# EAGLE design rc4.1_1 (EAGLE 9.6.2)
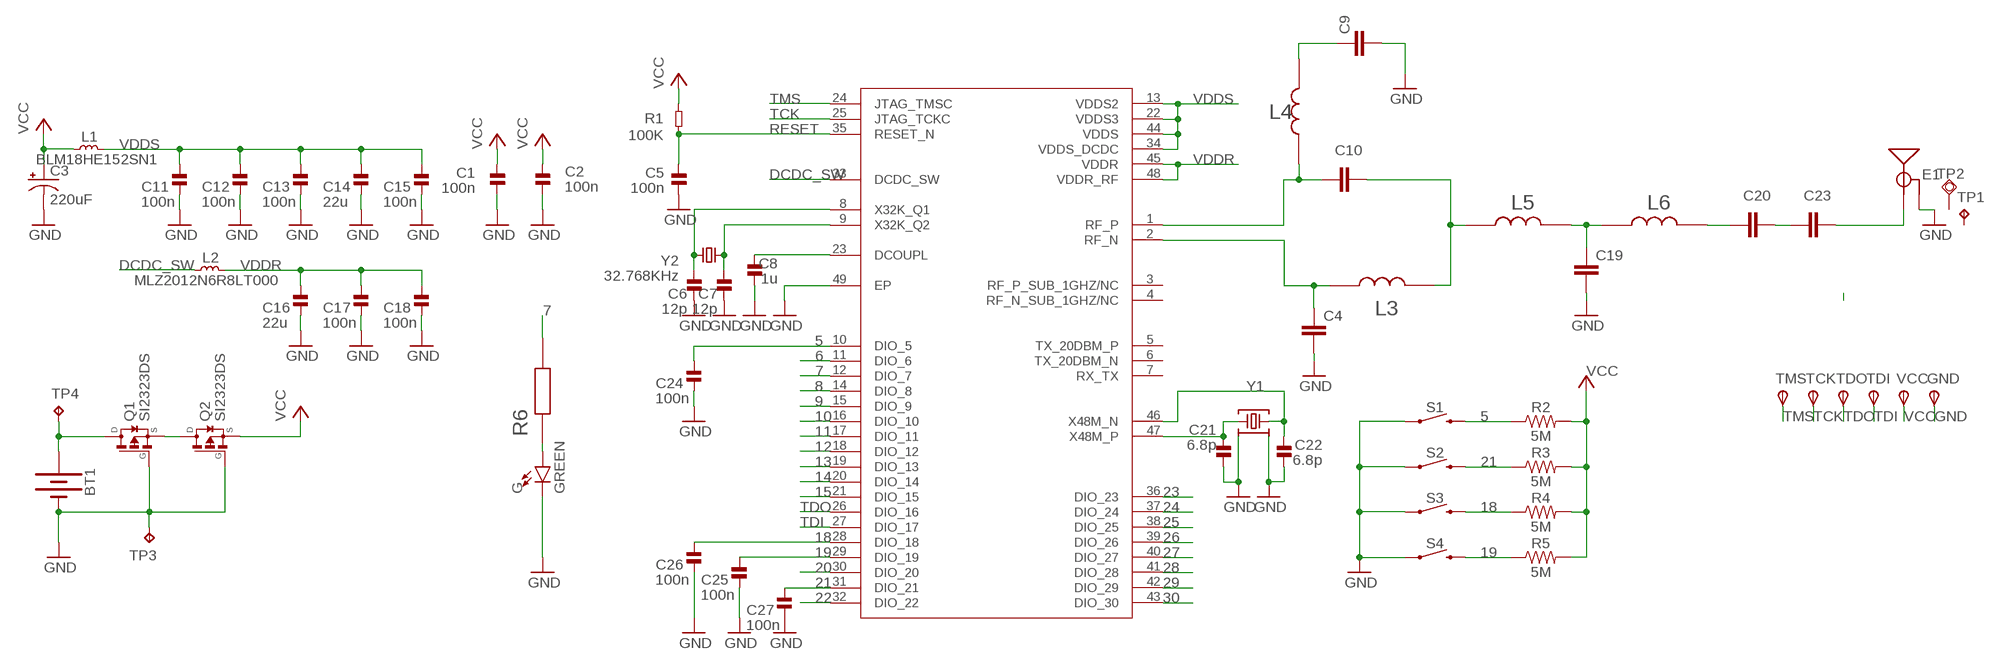
[diagram p0: schematic, sheet 1]

## Parts
BT1  BATTERY-20MM_SMD_4LEGS_OVERPASTE  [BATTCON_20MM_4LEGS_OVERPASTE]
C1  100n  CAP-0402  [_PKG_C_0402]
C2  100n  CAP-0402  [_PKG_C_0402]
C3  220uF  47UF-POLAR-EIA3528-10V-10%  [EIA3528]
C4  1pf  CAP0402  [CAPC1005X40N]
C5  100n  CAP-0402  [_PKG_C_0402]
C6  12p  CAP-0402  [_PKG_C_0402]
C7  12p  CAP-0402  [_PKG_C_0402]
C8  1u  CAP-0402  [_PKG_C_0402]
C9  12pF  CAP0402  [CAPC1005X40N]
C10  1pF  CAP0402  [CAPC1005X40N]
C11  100n  CAP-0402  [_PKG_C_0402]
C12  100n  CAP-0402  [_PKG_C_0402]
C13  100n  CAP-0402  [_PKG_C_0402]
C14  22u  CAP-0805  [_PKG_C_0805]
C15  100n  CAP-0402  [_PKG_C_0402]
C16  22u  CAP-0805  [_PKG_C_0805]
C17  100n  CAP-0402  [_PKG_C_0402]
C18  100n  CAP-0402  [_PKG_C_0402]
C19  1pF  CAP0402  [CAPC1005X40N]
C20  12p  CAP0402  [CAPC1005X40N]
C21  6.8p  CAP-0402  [_PKG_C_0402]
C22  6.8p  CAP-0402  [_PKG_C_0402]
C23  1.8pF  CAP0402  [CAPC1005X40N]
C24  100n  CAP-0402  [_PKG_C_0402]
C25  100n  CAP-0402  [_PKG_C_0402]
C26  100n  CAP-0402  [_PKG_C_0402]
C27  100n  CAP-0402  [_PKG_C_0402]
E1  ANTENNA-GROUNDEDTRACE-15.2MM  [TRACE_ANTENNA_2.4GHZ_15.2MM]
G  GREEN  LED-GREEN0603  [LED-0603]
GND  TPSTP11R  [TP11R]
IC3  CC2652R1FRGZ  CC2652P1FRGZRRGZ0048A-IPC_B  [RGZ0048A-IPC_B]
L1  BLM18HE152SN1  INDUCTOR-0603  [_PKG_L_0603]
L2  MLZ2012N6R8LT000  INDUCTOR-0805  [_PKG_C_0805]
L3  2.4nH  IND0402IND0402  [INDC1005X40N]
L4  2.4nH  IND0402IND0402  [INDC1005X40N]
L5  2nH  IND0402IND0402  [INDC1005X40N]
L6  2nH  IND0402IND0402  [INDC1005X40N]
Q1  SI2323DS  [SOT23]
Q2  SI2323DS  [SOT23]
R1  100K  RES-0402  [_PKG_C_0402]
R2  5M  2.49KOHM-0603-1/10W-1%  [0603]
R3  5M  2.49KOHM-0603-1/10W-1%  [0603]
R4  5M  2.49KOHM-0603-1/10W-1%  [0603]
R5  5M  2.49KOHM-0603-1/10W-1%  [0603]
R6  2.2k  RES0402  [RESC1005X40N]
S1  MOMENTARY-SWITCH-SPST-SMD-5.2MM  [TACTILE_SWITCH_SMD_5.2MM]
S2  MOMENTARY-SWITCH-SPST-SMD-5.2MM  [TACTILE_SWITCH_SMD_5.2MM]
S3  MOMENTARY-SWITCH-SPST-SMD-5.2MM  [TACTILE_SWITCH_SMD_5.2MM]
S4  MOMENTARY-SWITCH-SPST-SMD-5.2MM  [TACTILE_SWITCH_SMD_5.2MM]
TCK  TPSTP11R  [TP11R]
TDI  TPSTP11R  [TP11R]
TDO  TPSTP11R  [TP11R]
TMS  TPSTP11R  [TP11R]
TP1  TPTP06SQ  [TP05SQ]
TP2  TPSQTP15SQ  [TP15SQ]
TP3  TPB2,54  [B2,54]
TP4  TPB2,54  [B2,54]
VCC  TPSTP11R  [TP11R]
Y1  Q22FA12800150  48.000MHZ_CX2016DB48000C0FPLC1  [XTAL-4P-2016]
Y2  32.768KHz  32.768KHZ_Q13FC1350000400  [XTAL-2P-3215]

## Nets
5: C24.1 IC3.10(DIO_5) R2.1 S1.3
6: IC3.11(DIO_6)
7: IC3.12(DIO_7) R6.2
8: IC3.14(DIO_8)
9: IC3.15(DIO_9)
10: IC3.16(DIO_10)
11: IC3.17(DIO_11)
12: IC3.18(DIO_12)
13: IC3.19(DIO_13)
14: IC3.20(DIO_14)
15: IC3.21(DIO_15)
18: C26.1 IC3.28(DIO_18) R4.1 S3.3
19: C25.1 IC3.29(DIO_19) R5.1 S4.3
20: IC3.30(DIO_20)
21: C27.1 IC3.31(DIO_21) R3.1 S2.3
22: IC3.32(DIO_22)
23: IC3.36(DIO_23)
24: IC3.37(DIO_24)
25: IC3.38(DIO_25)
26: IC3.39(DIO_26)
27: IC3.40(DIO_27)
28: IC3.41(DIO_28)
29: IC3.42(DIO_29)
30: IC3.43(DIO_30)
DCDC_SW: IC3.33(DCDC_SW) L2.1
DCOUPL: C8.2 IC3.23(DCOUPL)
GND: BT1.2(-) C1.1 C2.1 C3.C(-) C4.2 C5.1 C6.1 C7.1 C8.1 C9.2 C11.2 C12.2 C13.2 C14.2 C15.2 C16.2 C17.2 C18.2 C19.2 C21.1 C22.1 C24.2 C25.2 C26.2 C27.2 E1.GND G.C GND.TP(PP) IC3.49(EP) Q1.1(G) Q2.1(G) S1.1 S2.1 S3.1 S4.1 TP3.TP Y1.2 Y1.4
N$1: C20.2 C23.1
N$3: C20.1 L6.2
N$4: C22.2 IC3.46(X48M_N) Y1.3
N$6: BT1.1(+) Q1.3(D) TP4.TP
N$11: G.A R6.1
N$15: Q1.2(S) Q2.3(D)
N$18: C10.1 IC3.1(RF_P) L4.1
N$19: C4.1 IC3.2(RF_N) L3.1
N$20: C10.2 L3.2 L5.1
N$21: C21.2 IC3.47(X48M_P) Y1.1
N$22: C9.1 L4.2
N$24: C23.2 E1.ANT(SIGNAL)
N$25: C19.1 L5.2 L6.1
RESET: C5.2 IC3.35(RESET_N) R1.1
TCK: IC3.25(JTAG_TCKC) TCK.TP(PP)
TDI: IC3.27(DIO_17) TDI.TP(PP)
TDO: IC3.26(DIO_16) TDO.TP(PP)
TMS: IC3.24(JTAG_TMSC) TMS.TP(PP)
VCC: C1.2 C2.2 C3.A(+) L1.1 Q2.2(S) R1.2 R2.2 R3.2 R4.2 R5.2 VCC.TP(PP)
VDDR: C16.1 C17.1 C18.1 IC3.45(VDDR) IC3.48(VDDR_RF) L2.2
VDDS: C11.1 C12.1 C13.1 C14.1 C15.1 IC3.13(VDDS2) IC3.22(VDDS3) IC3.34(VDDS_DCDC) IC3.44(VDDS) L1.2
X32K_Q1: C6.2 IC3.8(X32K_Q1) Y2.1
X32K_Q2: C7.2 IC3.9(X32K_Q2) Y2.2
Unconnected: IC3.3(RF_P_SUB_1GHZ/NC) IC3.4(RF_N_SUB_1GHZ/NC) IC3.5(TX_20DBM_P) IC3.6(TX_20DBM_N) IC3.7(RX_TX) TP1.TP TP2.TP

## Library data of the parts
BT1 = Batteries:BATTERY: Battery - Single Cell A variety of battery chemistries, sizes, and footprints. Device List: 20MM_PTH - Coin Cell Battery Holder - 20mm (PTH) <https://www.sparkfun.com/products/783> 6.8MM_PTH - Coin Cell Battery Holder - 6.8MM(SMD) <https://www.digikey.com/product-detail/en/seiko-instruments/MS621FE-FL11E/728-1057-ND/1889208?WT.srch=1&gclid=CNOQ5a6LzdQCFZS2wAodXCkE0g> 12MM_SMD - Coin Cell Battery Holder - 12mm (SMD) <https://www.sparkfun.com/products/10592> 12MM_PTH - Coin Cell Battery Holder - 12mm (PTH) <https://www.sparkfun.com/products/7948> 20MM_SMD - 20mm Coin Cell Battery Holder (SMD) (2 legs) Used on the Big Time Watch Kit <https://www.sparkfun.com/products/11734> 20MM_SMD_4LEGS - Coin Cell Battery Holder - 20mm (SMD) <https://www.sparkfun.com/products/11892> 20MM_SMD_4LEGS_OVERPASTE - Coin Cell Battery Holder - 20mm (SMD) <https://www.sparkfun.com/products/11892> (Over-paste on the legs) 24.5MM_PTH - Coin Cell Battery Holder - 24.5mm (PTH) <https://www.sparkfun.com/products/8863> 9V - 9V Battery Holder - PC Mount Used on the SparkFun SparkPunk Sound Kit <https://www.sparkfun.com/products/11177> and SparkFun SparkPunk Sequencer Kit <https://www.sparkfun.com/products/12707> 18650 - Battery Holder - 18650 (PTH) <https://www.sparkfun.com/products/13113> AA - Battery Holder - 1xAA (PTH) <https://www.sparkfun.com/products/7949> AAA - Battery Holder - 1xAAA (PTH) <https://www.sparkfun.com/products/12718> AA_KIT - Battery Holder - 1xAA (PTH) <https://www.sparkfun.com/products/7949> Special kit package - pads only have exposed copper on one side of the board. AAA_KIT - Battery Holder - 1xAAA (PTH) <https://www.sparkfun.com/products/12718> Special kit package - pads only have exposed copper on one side of the board.; PROD_ID: PRT-11892; SF_SKU: BATT-10373
C1 C2 C5-C8 C11-C18 C21 C22 C24-C27 = ok-discretes-dev:CAP
C3 = SparkFun-Capacitors:47UF-POLAR: 47µF polarized capacitors A capacitor is a passive two-terminal electrical component used to store electrical energy temporarily in an electric field.; PROD_ID: CAP-08310; VALUE: 47uF
C4 C9 C10 C19 C20 C23 = discretes-dev:CAP0402: CAP, 0402; AVAILABILITY: Good; DESCRIPTION: RESISTOR, 0402 0.063W 1% 3M6; Resistance:3.6Mohm; Resistance Tolerance:± 1%; Power Rating:0.063W; Voltage Rating:50V; Series:RC32H; Temperature Coefficient:± 100ppm/°C; Resistor Element Type:Thick Film; Resistor Case Style:0402; No. of Pins:2; SVHC:No SVHC; Case Style:0402; External Length / Height:1mm; Temperature Coeff. +:100ppm/°C; Temperature Coeff. -:100ppm/°C; External Depth:0.35mm; External Width:0.5mm; Operating Temperature Range:-55°C to +155°C; Overload Voltage:100V; MF: Yageo; MP: RC0402FR-073M6L; PACKAGE: 1005 Panasonic Electronic Components; PRICE: None; PURCHASE-URL: https://pricing.snapeda.com/search/part/RC0402FR-073M6L/?ref=eda
E1 = SparkFun-RF2:ANTENNA-GROUNDED: Antenna w/ Ground Connection 2.4GHz antennae with signal and ground terminals. TRACE_ANTENNA_2.4GHZ_15.2MM - Meander Trace antenna 15.2 x 5.7mm footprint Based on layout from TI app note AN043 <http://www.ti.com/lit/an/swra117d/swra117d.pdf>. TRACE_ANTENNA_2.4GHZ_25.7MM - Inverted F trace antenna 25.7 x 7.5 mm footprint. Based on layout from TI design note DN0007 <http://www.ti.com/lit/an/swru120b/swru120b.pdf>.
G = SparkFun-LED:LED-GREEN: Green SMD LED Used in manufacturing of various products at SparkFun Packages: 0603 - SMD 0603 package [Product Link] <http://www.futureelectronics.com/en/technologies/semiconductors/optoelectronics/leds/Pages/9894312-LTST-C190GKT.aspx?CrossPart=HSMG-C190&IM=0> LilyPad 1206 - SMD1206 LilyPad package [Product Link] <http://www.futureelectronics.com/en/Technologies/Product.aspx?ProductID=IN150NGHARVATEKCORPORATION2049943&IM=0> 1206 - SMD1206 package [Product Link] <http://www.futureelectronics.com/en/technologies/semiconductors/optoelectronics/leds/Pages/8315665-LTST-C150KGKT.aspx?IM=0> 1206 Bottom Mount -SMD 1206 Bottom Mount [Product Link] <http://www.digikey.com/product-detail/en/lite-on-inc/LTST-C230KGKT/160-1456-1-ND/386854> SparkFun Products: Pro Mini 328 -5V <https://www.sparkfun.com/products/821> RedBoard <https://www.sparkfun.com/products/12757> MP3 Trigger <https://www.sparkfun.com/products/13720> Makey Makey <https://www.sparkfun.com/products/11076>; PROD_ID: DIO-00821
GND TCK TDI TDO TMS VCC = testpad:TPS: TEST PIN
IC3 = CC2652P1FRGZR:CC2652P1FRGZR; COPYRIGHT: Copyright (C) 2022 Ultra Librarian. All rights reserved.; MANUFACTURER_PART_NUMBER: CC2652P1FRGZR; MFR_NAME: Texas Instruments; REFDES: RefDes; TYPE: TYPE
L1 L2 = ok-discretes-dev:INDUCTOR
L3-L6 = discretes-dev:IND0402: RESISTOR, 0402 0.063W 1% 3M6; Resistance:3.6Mohm; Resistance Tolerance:± 1%; Power Rating:0.063W; Voltage Rating:50V; Series:RC32H; Temperature Coefficient:± 100ppm/°C; Resistor Element Type:Thick Film; Resistor Case Style:0402; No. of Pins:2; SVHC:No SVHC; Case Style:0402; External Length / Height:1mm; Temperature Coeff. +:100ppm/°C; Temperature Coeff. -:100ppm/°C; External Depth:0.35mm; External Width:0.5mm; Operating Temperature Range:-55°C to +155°C; Overload Voltage:100V Check prices <https://pricing.snapeda.com/parts/RC0402FR-073M6L/Yageo/view-part?ref=eda>; AVAILABILITY: Good; DESCRIPTION: RESISTOR, 0402 0.063W 1% 3M6; Resistance:3.6Mohm; Resistance Tolerance:± 1%; Power Rating:0.063W; Voltage Rating:50V; Series:RC32H; Temperature Coefficient:± 100ppm/°C; Resistor Element Type:Thick Film; Resistor Case Style:0402; No. of Pins:2; SVHC:No SVHC; Case Style:0402; External Length / Height:1mm; Temperature Coeff. +:100ppm/°C; Temperature Coeff. -:100ppm/°C; External Depth:0.35mm; External Width:0.5mm; Operating Temperature Range:-55°C to +155°C; Overload Voltage:100V; MF: Yageo; MP: RC0402FR-073M6L; PACKAGE: 1005 Panasonic Electronic Components; PRICE: None; PURCHASE-URL: https://pricing.snapeda.com/search/part/RC0402FR-073M6L/?ref=eda
Q1 Q2 = SI2323DS:SI2323DS: P-Channel MOSFET; AVAILABILITY: Unavailable; DESCRIPTION: P-Channel 20V 3.7A (Ta) 750mW (Ta) Surface Mount SOT-23-3 (TO-236); MF: Vishay Siliconix; MP: SI2323DS; PACKAGE: SOT-23-3 Vishay Siliconix; PRICE: None
R1 = ok-discretes-dev:RES
R2-R5 = SparkFun-Resistors:2.49KOHM: 2.49kΩ resistor A resistor is a passive two-terminal electrical component that implements electrical resistance as a circuit element. Resistors act to reduce current flow, and, at the same time, act to lower voltage levels within circuits. - Wikipedia; PROD_ID: RES-09568; VALUE: 2.49k
R6 = discretes-dev:RES0402: RESISTOR, 0402 0.063W 1% 3M6; Resistance:3.6Mohm; Resistance Tolerance:± 1%; Power Rating:0.063W; Voltage Rating:50V; Series:RC32H; Temperature Coefficient:± 100ppm/°C; Resistor Element Type:Thick Film; Resistor Case Style:0402; No. of Pins:2; SVHC:No SVHC; Case Style:0402; External Length / Height:1mm; Temperature Coeff. +:100ppm/°C; Temperature Coeff. -:100ppm/°C; External Depth:0.35mm; External Width:0.5mm; Operating Temperature Range:-55°C to +155°C; Overload Voltage:100V Check prices <https://pricing.snapeda.com/parts/RC0402FR-073M6L/Yageo/view-part?ref=eda>; AVAILABILITY: Good; DESCRIPTION: RESISTOR, 0402 0.063W 1% 3M6; Resistance:3.6Mohm; Resistance Tolerance:± 1%; Power Rating:0.063W; Voltage Rating:50V; Series:RC32H; Temperature Coefficient:± 100ppm/°C; Resistor Element Type:Thick Film; Resistor Case Style:0402; No. of Pins:2; SVHC:No SVHC; Case Style:0402; External Length / Height:1mm; Temperature Coeff. +:100ppm/°C; Temperature Coeff. -:100ppm/°C; External Depth:0.35mm; External Width:0.5mm; Operating Temperature Range:-55°C to +155°C; Overload Voltage:100V; MF: Yageo; MP: RC0402FR-073M6L; PACKAGE: 1005 Panasonic Electronic Components; PRICE: None; PURCHASE-URL: https://pricing.snapeda.com/search/part/RC0402FR-073M6L/?ref=eda
S1-S4 = SparkFun-Switches:MOMENTARY-SWITCH-SPST: Momentary Switch (Pushbutton) - SPST Normally-open (NO) SPST momentary switches (buttons, pushbuttons). Variants PTH-12MM - 12mm square, through-hole Momentary Pushbutton Switch - 12mm Square <https://www.sparkfun.com/products/9190> (COM-09190) PTH-6.0MM, PTH-6.0MM-KIT - 6.0mm square, through-hole Mini Pushbutton Switch <https://www.sparkfun.com/products/97> (COM-00097) KIT package intended for soldering kit's - only one side of pads' copper is exposed. PTH-RIGHT-ANGLE-KIT - Right-angle, through-hole Right Angle Tactile Button <https://www.sparkfun.com/products/10791> - Used on SparkFun BigTime Watch Kit <https://www.sparkfun.com/products/11734> SMD-12MM - 12mm square, surface-mount Tactile Button - SMD (12mm) <https://www.sparkfun.com/products/12993> (COM-12993) Used on SparkFun PicoBoard <https://www.sparkfun.com/products/11888> SMD-4.5MM - 4.5mm Square Trackball Switch Used on SparkFun Blackberry Trackballer Breakout <https://www.sparkfun.com/products/13169> SMD-4.6MMX2.8MM - 4.60mm x 2.80mm, surface mount Used on SparkFun SAMD21 Mini Breakout <https://www.sparkfun.com/products/13664> SMD-5.2MM, SMD-5.2-REDUNDANT - 5.2mm square, surface-mount Mini Pushbutton Switch - SMD <https://www.sparkfun.com/products/8720> (COM-08720) Used on Arduino Pro Mini <https://www.sparkfun.com/products/11114> REDUNDANT package connects both switch circuits together SMD-6.0X3.5MM - 6.0 x 3.5mm, surface mount Momentary Reset Switch SMD <https://www.sparkfun.com/products/8229> (COM-08229) SMD-6.2MM-TALL - 6.2mm square, surface mount Tactile Button - SMD (6mm) <https://www.sparkfun.com/products/12992> Used on SparkFun Digital Sandbox <https://www.sparkfun.com/products/12651> SMD-RIGHT-ANGLE - Right-angle, surface mount Used on SparkFun Block for Intel® Edison - Arduino <https://www.sparkfun.com/products/13036>; PROD_ID: SWCH-08247; SF_SKU: COM-08720
TP1 TP3 TP4 = testpad:TP: Test pad
TP2 = testpad:TPSQ: Test pad
Y1 = ok-xtal-osc-dev:48.000MHZ_CX2016DB48000C0FPLC1: 48MHz ±10ppm Crystal 7pF 50 Ohms 4-SMD, No Lead Datasheet <https://media.digikey.com/pdf/Data%20Sheets/Kyocera%20International/CX2016DB48000C0FPLC1_DS.pdf>; DIGIKEY_PART: 1253-2042-1-ND; MFG_NAME: KYOCERA; MFG_PART: CX2016DB48000C0FPLC1
Y2 = ok-xtal-osc-dev:32.768KHZ_Q13FC1350000400: SMD Crystal Resonators 32.768KHz +/-20ppm SMD-3215_2P RoHS Datasheet <https://datasheet.lcsc.com/szlcsc/1901081604_Seiko-Epson-Q13FC1350000400_C32346.pdf>; LCSC_PART: C32346; MFG_NAME: SEIKO EPSON; MFG_PART: Q13FC1350000400

## Board
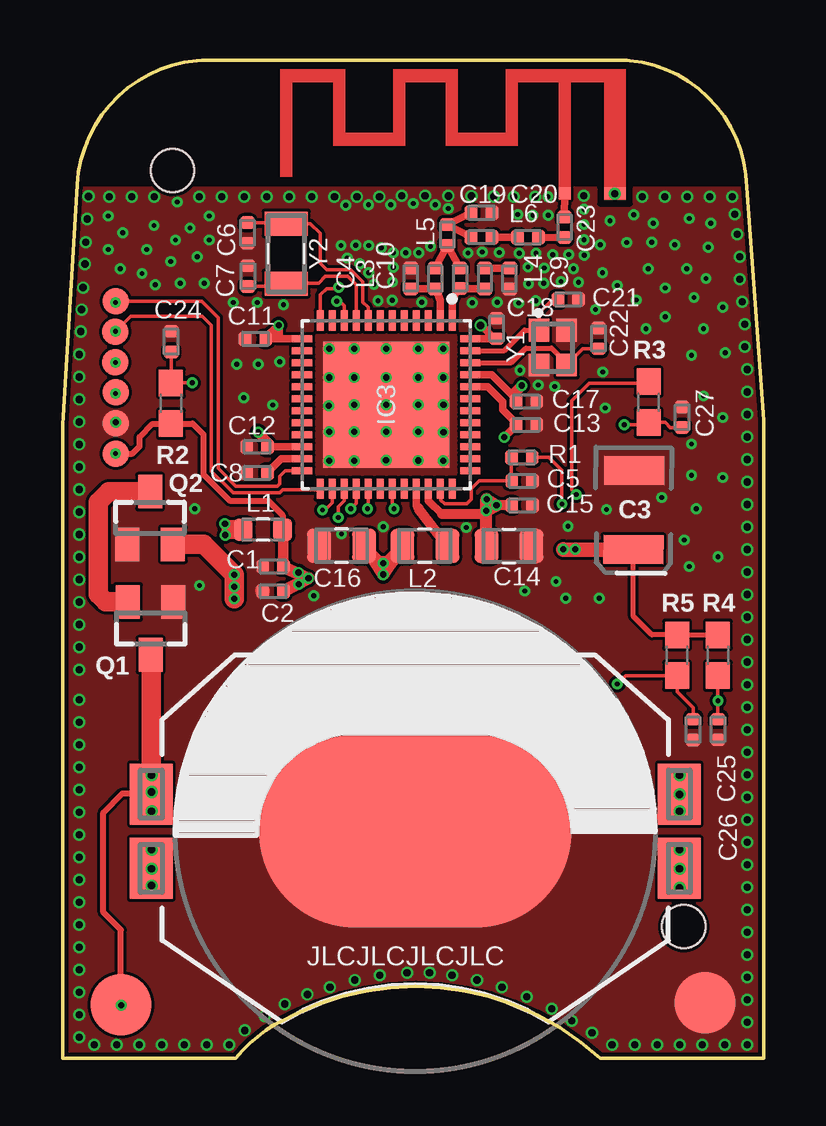
[diagram p1: board, top side]
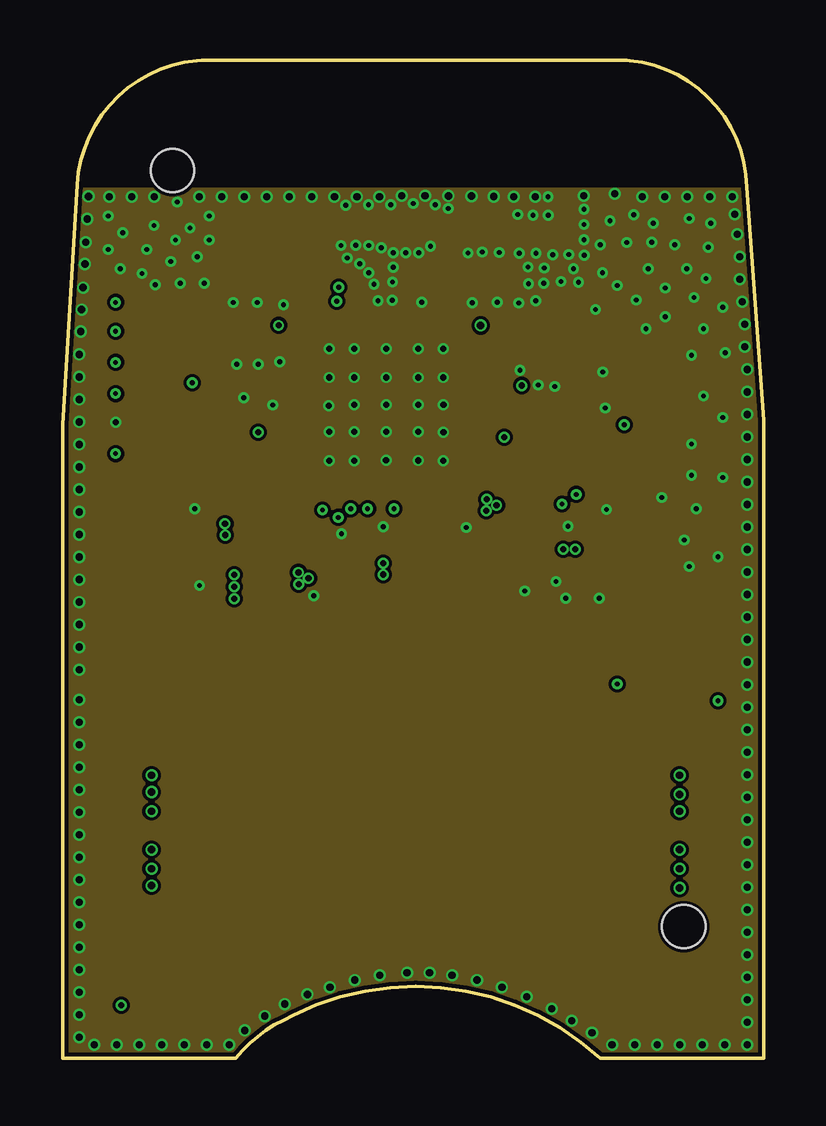
[diagram p2: board, inner layer Route2]
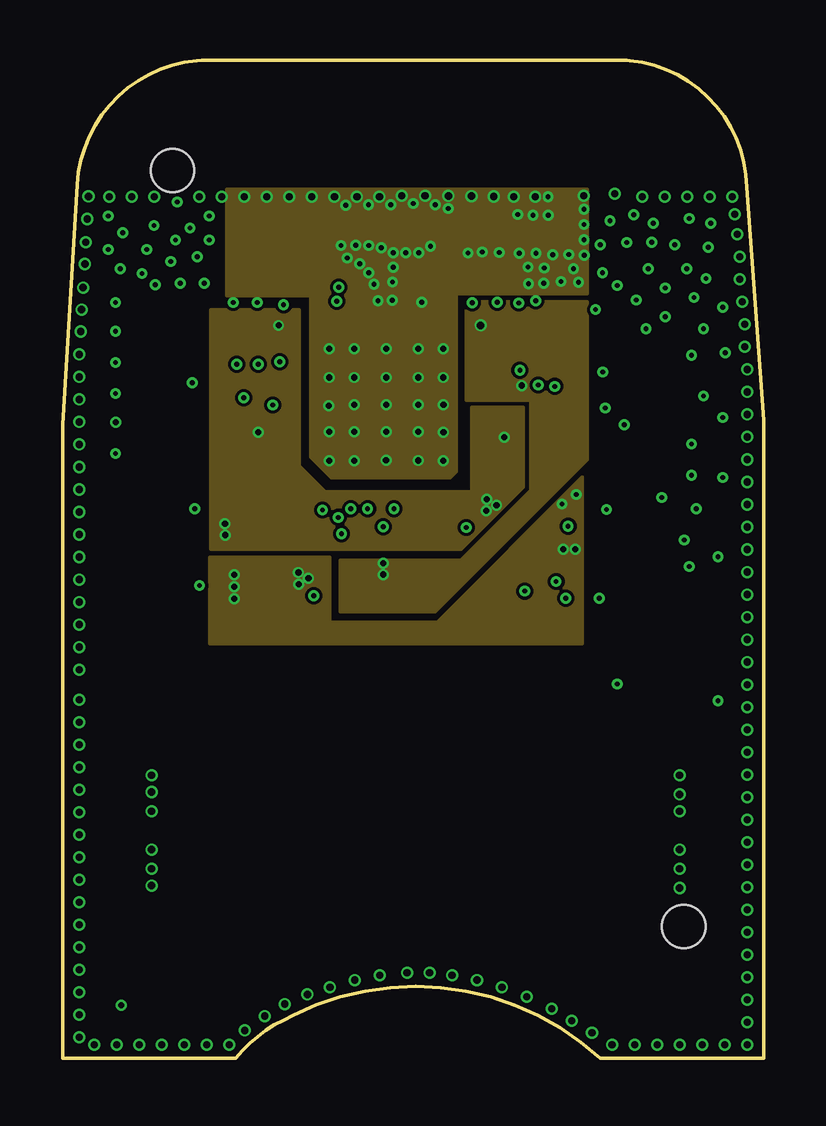
[diagram p3: board, inner layer Route15]
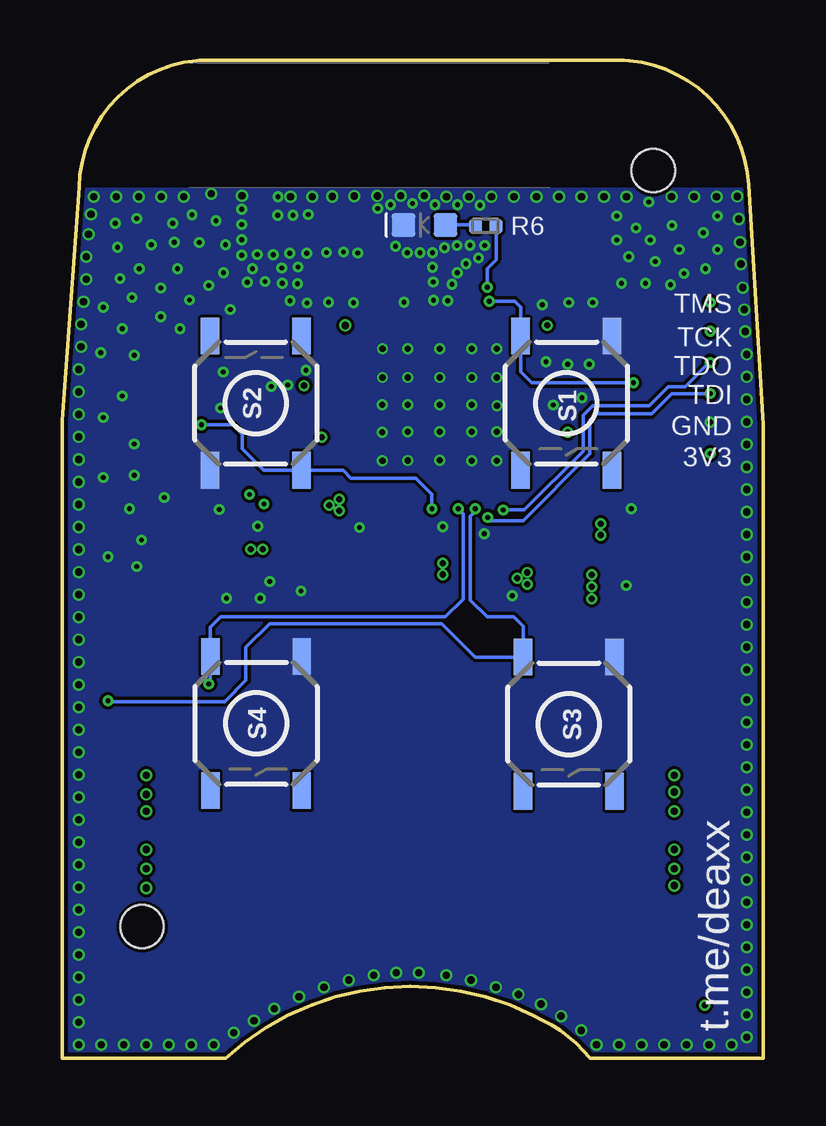
[diagram p4: board, bottom side, seen from below]

Size 29.2 x 41.6 mm. Coordinates in mm from the lower left corner, seen from the top.
Outline: 6.1,41.6 23.1,41.6
Outline: 23.1,41.6 23.5,41.6
Outline: 6.1,41.6 5.8,41.6
Outline: 6.1,41.6 arc87 0.6,36.4 0,26.4 0,0 7.2,0 arc-24 9.2,1.6 9.6,1.8 arc-69 22.4,0 29.2,0 29.2,26.6 28.5,36.3 arc89 23.1,41.6
Copper layers (1*2*15*16): Top 0.035559375mm / dielectric 0.17018125mm / Route2 0.01778125mm / dielectric 0.4mm / Route15 0.01778125mm / dielectric 0.17018125mm / Bottom 0.035559375mm
Design rules "oshpark-4layer *": minimum track width 6mil, minimum drill 0.2mm, track to track 5mil, track to pad 5mil, pad to pad 5mil, via to via 5mil, smd to smd 5mil, copper to edge 0.16mm, drill to drill 0.2mm, minimum pad ring 4mil, minimum via ring 4mil, stop-mask expansion 2.5mil, vias tented up to drill 50mil, thermal gap 10mil
Holes 1.8 mm at 25.88,5.49 4.58,36.99
tRestrict: area 8.5,32.8 to 10.2,34.3; 3 lines

### Footprints (pad centres in the part's own frame; a part is rotated, then mirrored left to right if it is on the bottom)
BATTCON_20MM_4LEGS_OVERPASTE = smd 1.778 x 2.54: 1 -11,1.55; 3 11,1.55; P$1 -11,-1.55; P$2 11,-1.55 | smd 13 x 8: 2 0,0
_PKG_C_0402 = smd 0.54 x 0.6: 1 -0.43,0; 2 0.43,0
EIA3528 = smd 1.2 x 2.5: A 1.65,0; C -1.65,0
CAPC1005X40N = smd 0.54 x 0.6: 1 -0.432,0; 2 0.432,0
_PKG_C_0805 = smd 1 x 1.42: 1 -0.935,0; 2 0.935,0
TRACE_ANTENNA_2.4GHZ_15.2MM = smd 0.5 x 0.5: ANT -3.127,-0.25 | smd 0.9 x 0.5: GND -1.027,-0.25
LED-0603 = smd 1 x 1: A -0.877,0; C 0.877,0
TP11R = smd 1.1 x 1.1: TP 0,0
RGZ0048A-IPC_B = smd 0.85 x 0.3: 1 -3.501,2.75; 2 -3.501,2.25; 3 -3.501,1.75; 4 -3.501,1.25; 5 -3.501,0.75; 6 -3.501,0.25; 7 -3.501,-0.25; 8 -3.501,-0.75; 9 -3.501,-1.25; 10 -3.501,-1.75; 11 -3.501,-2.25; 12 -3.501,-2.75; 25 3.501,-2.75; 26 3.501,-2.25; 27 3.501,-1.75; 28 3.501,-1.25; 29 3.501,-0.75; 30 3.501,-0.25; 31 3.501,0.25; 32 3.501,0.75; 33 3.501,1.25; 34 3.501,1.75; 35 3.501,2.25; 36 3.501,2.75 | smd 0.3 x 0.85: 13 -2.75,-3.501; 14 -2.25,-3.501; 15 -1.75,-3.501; 16 -1.25,-3.501; 17 -0.75,-3.501; 18 -0.25,-3.501; 19 0.25,-3.501; 20 0.75,-3.501; 21 1.25,-3.501; 22 1.75,-3.501; 23 2.25,-3.501; 24 2.75,-3.501; 37 2.75,3.501; 38 2.25,3.501; 39 1.75,3.501; 40 1.25,3.501; 41 0.75,3.501; 42 0.25,3.501; 43 -0.25,3.501; 44 -0.75,3.501; 45 -1.25,3.501; 46 -1.75,3.501; 47 -2.25,3.501; 48 -2.75,3.501 | smd 5.25 x 5.25: 49 0,0
_PKG_L_0603 = smd 0.79 x 0.93: 1 -0.82,0; 2 0.82,0
INDC1005X40N = smd 0.54 x 0.6: 1 -0.432,0; 2 0.432,0
SOT23 = smd 1 x 1.4: 1 -0.95,-1.1; 2 0.95,-1.1; 3 0,1.1
0603 = smd 1.1 x 1: 1 -0.85,0; 2 0.85,0
RESC1005X40N = smd 0.54 x 0.6: 1 -0.432,0; 2 0.432,0
TACTILE_SWITCH_SMD_5.2MM = smd 1.524 x 0.762: 1 -2.794,1.905; 2 2.794,1.905; 3 -2.794,-1.905; 4 2.794,-1.905
TP05SQ = smd 0.5 x 0.5: TP 0,0
TP15SQ = smd 0.5 x 0.9: TP 0,0
B2,54 = smd 2.54 x 2.54: TP 0,0
XTAL-4P-2016 = smd 0.95 x 0.85: 1 -0.725,-0.575; 2 0.725,-0.575; 3 0.725,0.575; 4 -0.725,0.575
XTAL-2P-3215 = smd 1 x 1.8: 1 -1.25,0; 2 1.25,0

### Placement (x,y rotation side)
BT1  14.69,9.46 0 top
C1  8.76,20.49 0 top
C2  8.76,19.46 0 top
C3  23.8,22.85 269.5 top
C4  14.49,32.5 90 top
C5  19.14,24.06 180 top
C6  7.69,34.39 90 top
C7  7.71,32.6 270 top
C8  8.1,24.4 0 top
C9  18.62,32.5 270 top
C10  16.54,32.5 90 top
C11  8.03,29.98 180 top
C12  8.1,25.48 180 top
C13  19.32,26.4 0 top
C14  18.6,21.35 0 top
C15  19.14,23.05 0 top
C16  11.62,21.36 180 top
C17  19.32,27.36 0 top
C18  18.08,30.41 90 top
C19  17.45,35.23 0 top
C20  19.38,34.21 0 top
C21  21.06,31.62 180 top
C22  22.33,30 270 top
C23  20.91,34.63 90 top
C24  4.52,29.86 90 top
C25  26.27,13.7 270 top
C26  27.3,13.7 270 top
C27  25.81,26.71 90 top
E1  24.04,36.29 0 top
G  14.11,34.73 180 bottom
GND  2.2,26.47 0 top
IC3  13.48,27.24 270 top
L1  8.34,22.03 180 top
L2  15.09,21.35 180 top
L3  15.52,32.49 90 top
L4  17.58,32.5 90 top
L5  16.02,34.31 90 top
L6  17.45,34.22 0 top
Q1  3.66,17.92 180 top
Q2  3.64,22.52 0 top
R1  19.13,25.04 0 top
R2  4.5,27.3 270 top
R3  24.41,27.35 90 top
R4  27.3,16.8 90 top
R5  25.6,16.8 90 top
R6  11.56,34.67 0 bottom
S1  8.2,27.3 270 bottom
S2  21.14,27.3 90 bottom
S3  8.1,13.92 270 bottom
S4  21.12,13.96 270 bottom
TCK  2.19,30.28 0 top
TDI  2.2,27.75 0 top
TDO  2.2,29.02 0 top
TMS  2.2,31.55 0 top
TP1  20.91,36.04 0 top
TP2  23.01,36.04 90 top
TP3  26.76,2.32 0 top
TP4  2.42,2.24 0 top
VCC  2.2,25.2 0 top
Y1  20.42,29.62 270 top
Y2  9.31,33.53 270 top

### Tracks (layer width: path | path; a pad name or v marks a point on that pad's centre or on a via)
5  (via drill 0.2 pad 0.45)
  Top 0.152: IC3.10 11.73,31.36 11.53,31.55 v11.41,31.55 | v5.4,28.15 R2.1 4.52,28.17 C24.1
  Bottom 0.152: v11.41,31.55 10.35,31.55 10.1,31.3 S1.3 10.1,28.6 9.65,28.15 v5.4,28.15
7  (via drill 0.2 pad 0.45)
  Top 0.152: IC3.12 10.73,31.81 10.99,32.08 11.44,32.08 v11.5,32.13
  Bottom 0.152: R6.2 11.13,33.27 11.5,32.91 v11.5,32.13
18  (via drill 0.2 pad 0.45)
  Top 0.152: v12,22.9 12.23,23.13 IC3.28 | R4.1 v27.3,14.9 | C26.1 v27.3,14.9 | v27.3,14.9
  Bottom 0.152: v12,22.9 12,22.8 12.2,22.6 12.2,19.1 11.5,18.4 10.4,18.4 10,18 S3.3 11.98,16.72 13.39,18.12 20.57,18.12 21.55,17.14 21.55,15.75 22.44,14.87 27.3,14.87 v27.3,14.9
19  (via drill 0.2 pad 0.45)
  Top 0.152: IC3.29 12.73,22.93 v12.7,22.9 | v23.1,15.6 23.45,15.95 R5.1 25.6,15.27 26.27,14.61 C25.1
  Bottom 0.152: v12.7,22.9 12.5,22.7 12.5,19.14 13.24,18.4 22.6,18.4 23.03,17.97 S4.3 23.03,15.67 v23.1,15.6
21  (via drill 0.2 pad 0.45)
  Top 0.152: IC3.31 13.73,22.97 v13.8,22.9 | v23.4,26.4 24.32,26.4 R3.1 25.09,26.5 25.31,26.28 C27.1
  Bottom 0.152: v13.8,22.9 13.8,23.5 14.48,24.18 17.18,24.18 17.5,24.5 S2.3 20.81,24.51 21.7,25.4 21.7,26 22.1,26.4 v23.4,26.4
24
  Top 0.152: IC3.37 17.03,24.38
DCDC_SW
  Top 0.305: 14.73,23.79 IC3.33 14.73,23.02 14.82,22.93
  Top 0.406: 16.18,21.51 16.18,21.38 16.16,21.35 L2.1 | L2.1 15.87,21.51 | L2.1 15.92,21.45 15.9,21.45 | L2.1 16.02,21.59 | L2.1 14.82,22.93
DCOUPL
  Top 0.305: IC3.23 9.11,24.99 C8.2
GND  (via drill 0.2 pad 0.45, 0.25 pad 0.46, 0.3)
  Top 0.152: v2.2,26.5 GND.TP
  Top 0.406: v23,36.03 E1.GND
  Top 0.61: 8.32,19.48 C2.1
  other vias: 12.14,28.37 13.48,27.24 12.14,26.1 12.14,27.24 13.48,28.37 14.81,28.37 14.81,27.24 14.81,26.1 13.48,26.1 11.1,26.1 11.09,27.2 11.1,28.37 15.86,26.09 15.86,27.24 15.86,28.37 11.1,24.9 12.14,24.9 13.47,24.92 14.81,24.91 15.86,24.91 11.1,29.57 12.14,29.57 13.48,29.57 14.81,29.57 15.86,29.57 1.07,35.92 1.94,35.9 2.88,35.9 3.81,35.9 5.69,35.9 6.63,35.9 7.57,35.9 8.5,35.9 9.44,35.9 10.38,35.9 11.32,35.9 12.26,35.9 13.2,35.9 14.12,35.94 15.1,35.94 16.07,35.93 24.14,35.9 25.08,35.9 26.02,35.9 26.95,35.9 27.89,35.9 1.02,34.97 0.96,34.01 0.92,33.1 0.85,32.12 0.78,31.2 0.75,30.29 0.69,29.33 0.69,28.4 0.69,27.46 0.69,26.52 0.69,25.58 0.69,24.64 0.69,23.7 0.69,22.77 0.69,21.83 0.69,20.89 0.69,18.08 0.69,17.14 0.69,16.2 0.69,9.32 0.69,8.38 0.69,7.44 0.69,6.51 0.69,5.57 0.69,4.63 0.69,3.69 0.69,2.75 0.69,1.82 0.69,0.88 1.31,0.56 2.25,0.56 3.19,0.56 4.13,0.56 5.07,0.56 6,0.56 6.94,0.56 7.58,1.16 8.42,1.76 9.26,2.26 10.19,2.66 11.13,2.96 12.17,3.26 13.21,3.46 14.35,3.56 15.28,3.56 16.22,3.46 17.26,3.26 18.3,2.96 19.34,2.56 20.37,2.06 21.21,1.56 22.05,1.06 22.89,0.56 23.83,0.56 24.77,0.56 25.7,0.56 26.64,0.56 27.58,0.56 28.52,0.56 28.52,1.5 28.52,2.44 28.52,3.38 28.52,4.32 28.52,5.26 28.52,6.19 28.52,7.13 28.52,8.07 28.52,9.01 28.52,9.95 28.52,10.88 28.52,11.82 28.52,12.76 28.52,13.7 28.52,14.64 28.52,15.57 28.52,16.51 28.52,17.45 28.52,18.39 28.52,19.33 28.52,20.27 28.52,21.2 28.52,22.14 28.52,23.08 28.52,24.02 28.52,24.96 28.52,25.89 28.52,26.83 28.52,27.77 28.52,28.71 28.42,29.65 28.42,30.58 28.32,31.52 28.2,32.46 28.2,33.4 28.1,34.34 28,35.17 0.69,10.26 0.69,11.2 0.69,12.13 0.69,13.07 0.69,14.01 0.69,14.95 0.69,19.95 0.69,19.01 12.97,32.25 13.14,31.57 12.74,32.74 12.38,33.11 12.21,33.88 12.75,33.87 13.27,33.77 14.83,33.57 2.5,34.4 4.5,33.2 3.3,32.7 6.1,34.1 4.7,34.1 2.4,32.9 4.9,32.3 23.5,34 25.1,32.1 23.1,32.2 25.5,33.9 27,34.8 24.6,34.8 22.8,34.9 26.7,30.4 26.8,32.5 25.1,30.9 27.5,26.7 26.7,27.6 22.2,31.2 26.2,25.6 27.5,24.2 26.2,24.3 26.4,22.9 24.96,23.37 22.5,28.6 22.6,27.1 20.5,28 19.81,28.06 5.5,22.9 5.7,19.7 3.8,34.7 6.1,35.1 5.3,34.6 1.9,35.1 1.9,33.7 3.5,33.7 5.6,33.4 5.9,32.3 24.4,32.9 22.49,32.74 22.4,33.9 26.9,33.8 27.5,31.3 26.3,31.7 26.2,29.3 27.6,29.4 26,32.9 26.1,35 24.3,30.4 21.28,32.9 21.72,34.75 23.9,31.6 27.3,20.9 26.1,20.5 25.9,21.6 3.86,32.23 24.54,34.01 4.77,35.69 7.24,28.92 9.04,29.02 8.74,27.22 8.14,28.92 7.54,27.52 7.1,31.5 8.1,31.5 9.2,31.4 13.77,33.57 20.56,19.87 21.06,22.17 19.26,19.47 20.96,19.17 22.36,19.17 22.66,22.87 10.46,19.27 11.62,21.86 11.86,33.35 11.6,33.87 16.82,22.12 13.35,22.15 17.48,33.6 18.19,33.58 19.01,33.55 19.72,33.54 20.23,35.13 20.22,35.9 17.03,35.93 17.95,35.91 18.79,35.9 19.69,35.9 19.59,35.13 18.96,35.16 16.89,33.56 15.32,33.84 13.73,31.58 13.74,32.35 13.78,32.97 19.38,32.98 19.4,32.28 20.06,32.94 20.04,32.3 21.71,35.95 21.72,35.38 21.72,34.11 16.06,35.41 23.79,35.15 14.61,35.62 13.67,35.57 12.74,35.57 11.79,35.55 14.96,31.51 17.07,31.49 18.11,31.5 19.71,31.56 19,31.47 14.29,33.57 21.08,33.49 21.49,32.35 20.76,32.37 20.41,33.48 21.73,33.47 15.52,35.57 19.05,28.68
  pour Route15: 11.19,24.19 16.14,24.19 16.4,24.44 16.4,31.87 21.86,31.87 21.86,36.22 6.83,36.22 6.83,31.77 10.33,31.77 10.33,25.05
  pour Route2: -0.63,36.22 -0.63,-0.62 29.59,-0.62 29.59,36.22
  pour Bottom (no thermals): -0.91,-0.43 30.11,-0.43 30.11,36.22 -0.91,36.22
  pour Top (no thermals): -1.04,-0.41 29.98,-0.41 29.98,36.25 -1.04,36.25
N$1
  Top 0.305: C20.2 C23.1
N$3
  Top 0.305: L6.2 C20.1
N$4
  Top 0.152: 20.99,28.99 Y1.3 21.6,29.51 21.66,29.57 C22.2
  Top 0.2: IC3.46 18.69,28.99 19.3,29.6 20.36,29.6 20.99,28.96 Y1.3
N$6  (via drill 0.25, 0.3)
  Top 0.152: TP4.TP v2.44,2.22
  Top 0.254: TP4.TP 2.42,5.35 1.69,6.08 1.69,10.24 2.49,11.04 3.7,11.04
  Top 0.406: 3.69,11.8 BT1.1 3.69,11.09 v3.7,11.1 | v3.7,11.1 v3.7,11.8 | v3.7,10.3 3.7,11.04 v3.7,11.1
  Top 0.813: Q1.3 3.69,16.79 3.69,11.8
N$7  (via drill 0.3)
  other vias: 3.7,8.7
N$8  (via drill 0.3)
  other vias: 3.7,7.9
N$9  (via drill 0.3)
  other vias: 3.7,7.2
N$10  (via drill 0.3)
  other vias: 25.7,11.8
N$11
  Bottom 0.152: 13.19,34.68 G.A 12.04,34.73 R6.1
N$12  (via drill 0.3)
  other vias: 25.7,10.3
N$13  (via drill 0.3)
  other vias: 25.7,11
N$14  (via drill 0.3)
  other vias: 25.7,8.7
N$15
  Top 0.813: Q1.2 1.79,19.02 1.47,19.34 1.47,23.17 1.92,23.62 Q2.3
N$16  (via drill 0.3)
  other vias: 25.7,7.9
N$17  (via drill 0.3)
  other vias: 25.7,7.1
N$18
  Top 0.305: IC3.1 16.23,31.52 16.45,32.07 C10.1 L4.1 | IC3.1
N$19
  Top 0.305: IC3.2 15.73,31.57 15.57,32.06 L3.1 C4.1
N$20
  Top 0.305: L3.2 L5.1 C10.2
N$21
  Top 0.152: 19.74,30.23 Y1.1 19.84,31.06 20.4,31.62 C21.2
  Top 0.2: Y1.1 19.24,30.34 18.39,29.49 IC3.47
N$22
  Top 0.305: L4.2 C9.1
N$24
  Top 0.305: E1.ANT C23.2
N$25
  Top 0.305: C19.1 L5.2 L6.1
RESET
  Top 0.152: IC3.35 15.75,23.76 15.75,23.26 15.91,23.1 16.83,23.1 17.03,23.29 17.03,23.74 17.36,24.08 18.7,24.08 | C5.2 18.7,24.08 | 18.7,24.08 R1.1
TCK  (via drill 0.2 pad 0.45)
  Top 0.152: IC3.25 10.63,23.69 9.17,23.69 9.04,23.57 7.09,23.57 6.19,24.47 6.19,30.55 5.82,30.92 2.83,30.92 TCK.TP v2.19,30.29 v2.2,30.3
TDI  (via drill 0.2 pad 0.45)
  Top 0.152: TDI.TP v2.2,27.7 | v11.48,22.54 11.48,22.98 11.73,23.23 IC3.27
  Bottom 0.152: v11.48,22.54 11.35,22.41 9.99,22.41 7.22,25.18 7.22,26.6 6.96,26.86 | 6.96,26.86 6.9,26.92 | 6.96,26.86 4.64,26.86 3.8,27.7 v2.2,27.7
TDO  (via drill 0.2 pad 0.45)
  Top 0.152: v2.2,29 TDO.TP | IC3.26 11.23,23.14 10.93,22.85 v10.82,22.85
  Bottom 0.152: v10.82,22.85 9.95,22.85 7.5,25.3 7.5,26.8 7.1,27.2 4.74,27.2 3.95,27.99 3.25,27.99 2.24,29 v2.2,29
TMS  (via drill 0.2 pad 0.45)
  Top 0.152: IC3.24 9.27,24.49 9.03,24.25 9.03,23.95 8.93,23.85 7.21,23.85 6.47,24.59 6.47,30.87 5.79,31.55 TMS.TP v2.2,31.5
VCC  (via drill 0.2 pad 0.45, 0.25 pad 0.46)
  Top 0.152: R1.2 20.26,25.04 20.8,24.5 v20.8,23.1 | R2.2 4.51,26.44 4.6,26.35 | R3.2 24.36,28.14 21.94,28.14 21.2,27.4 21.2,23.7 v21.4,23.5 | VCC.TP 2.3,25.3
  Top 0.203: C3.A 23.78,18.42 24.55,17.65 R5.2 R4.2
  Top 0.254: VCC.TP 2.9,25.2 3.2,25.5 3.2,25.9 3.74,26.44 4.51,26.44 | R2.2 5.41,26.45 5.86,26 5.86,24.33 6.96,23.24 8.56,23.24 9.16,22.64 L1.1
  Top 0.305: C1.2 v9.82,20.25 | C2.2 v9.83,19.76 | v9.83,19.76 v9.82,20.25 | v9.82,20.25 v10.24,20.01 v9.83,19.76
  Top 0.406: 9.2,22.03 | L1.1 9.2,22.03 | 9.2,22.03 C1.2 9.2,22.03
  Top 0.508: v20.85,21.21 v21.35,21.21 | v21.35,21.21 | v21.35,21.21 C3.A | C1.2 v10.24,20.01 C2.2
  Top 0.61: C3.A v20.86,21.2 v20.85,21.21
  Top 0.813: v7.14,20.15 5.87,21.42 Q2.2 | v7.14,20.15 v7.14,19.15 | v7.14,19.65 v7.14,20.15
  other vias: 2.2,25.2
  pour Route15: 6.13,20.87 11.13,20.87 11.13,18.18 15.6,18.18 21.64,24.23 21.64,17.27 6.13,17.27
VDDR  (via drill 0.25, 0.25 pad 0.46, 0.3)
  Top 0.305: 18.79,27.7 18.79,27.46 C17.1 18.89,27.46 17.87,28.49 IC3.45 | C18.1 | C18.1 | IC3.48 C18.1 | C18.1 17.98,29.99 | C18.1 17.99,29.99 17.43,30.54 v17.41,30.54
  Top 0.406: L2.2 13.8,20.93 13.95,20.88 v13.35,20.16 v13.36,20.63 | 14.08,21.25 L2.2 | C16.1 13.2,20.71 13.51,20.71 L2.2
  Top 0.432: 18.79,27.7 v19.13,28.04
  Top 0.508: C16.1 v13.35,20.16 14.08,21.25
  pour Route15: 16.82,27.43 19.51,27.43 19.51,23.68 16.59,20.76 11.57,20.76 11.57,18.61 15.52,18.61 21.85,24.94 21.85,31.52 16.82,31.52
VDDS  (via drill 0.25, 0.25 pad 0.45, 0.25 pad 0.46)
  Top 0.152: 7.52,22.05 L1.2
  Top 0.305: 18.69,23.07 C15.1 | v18.39,25.89 18.89,26.39 | C13.1 18.89,26.47 18.34,27.02 18.34,27.35 17.7,27.99 IC3.44 | 9.05,29.99 C11.1 | v8.99,30.54 9.05,29.99 | v6.76,22.27 7,22.03 L1.2 7.3,21.81 v6.76,21.81 v6.76,22.27 | v6.76,22.27 7.3,22.27 7.52,22.05 | 15.24,23.23 15.23,23.35 | 15.24,23.23 15.22,23.24 IC3.34 | 15.24,23.23 15.81,22.68 | IC3.22 C12.1 | IC3.13 9.05,29.99
  Top 0.406: 18.89,26.39 C13.1 | v8.99,30.54 8.99,30.52 C11.1 | C12.1 8.53,25.68 8.15,26.07 v8.15,26.09 | C14.1 17.66,21.55 | 17.66,21.55 | 17.66,21.55 17.66,21.7 | C15.1 v18.07,23.05 | 17.65,23.3 v17.66,23.31 | v17.65,22.82 17.52,22.68 15.81,22.68
  Top 0.508: C15.1 | C14.1 v17.65,22.82 | v17.65,22.82 17.65,23.3 | v17.66,23.31 v18.07,23.05 v17.65,22.82
  pour Route15: 19.19,27.14 19.19,23.8 16.6,21.2 6.16,21.2 6.16,31.19 9.86,31.19 9.86,24.7 10.94,23.62 17.03,23.62 17.03,27.14
X32K_Q1
  Top 0.152: C6.2 9.27,34.83 Y2.1 10.32,34.78 10.73,34.38 10.73,33.13 10.99,32.86 12,32.86 12.51,32.36 12.51,31.51 12.73,31.29 IC3.8
X32K_Q2
  Top 0.152: C7.2 9.2,32.17 Y2.2 9.34,32.31 10.66,32.31 10.94,32.58 11.88,32.58 12.23,32.24 IC3.9

### Text on the board
tNames: JLCJLCJLCJLC
bNames: TMS | TCK | TDO | TDI | GND | 3V3 | t.me/deaxx